# EAGLE design SMeter_RevB (EAGLE 7.6.0)
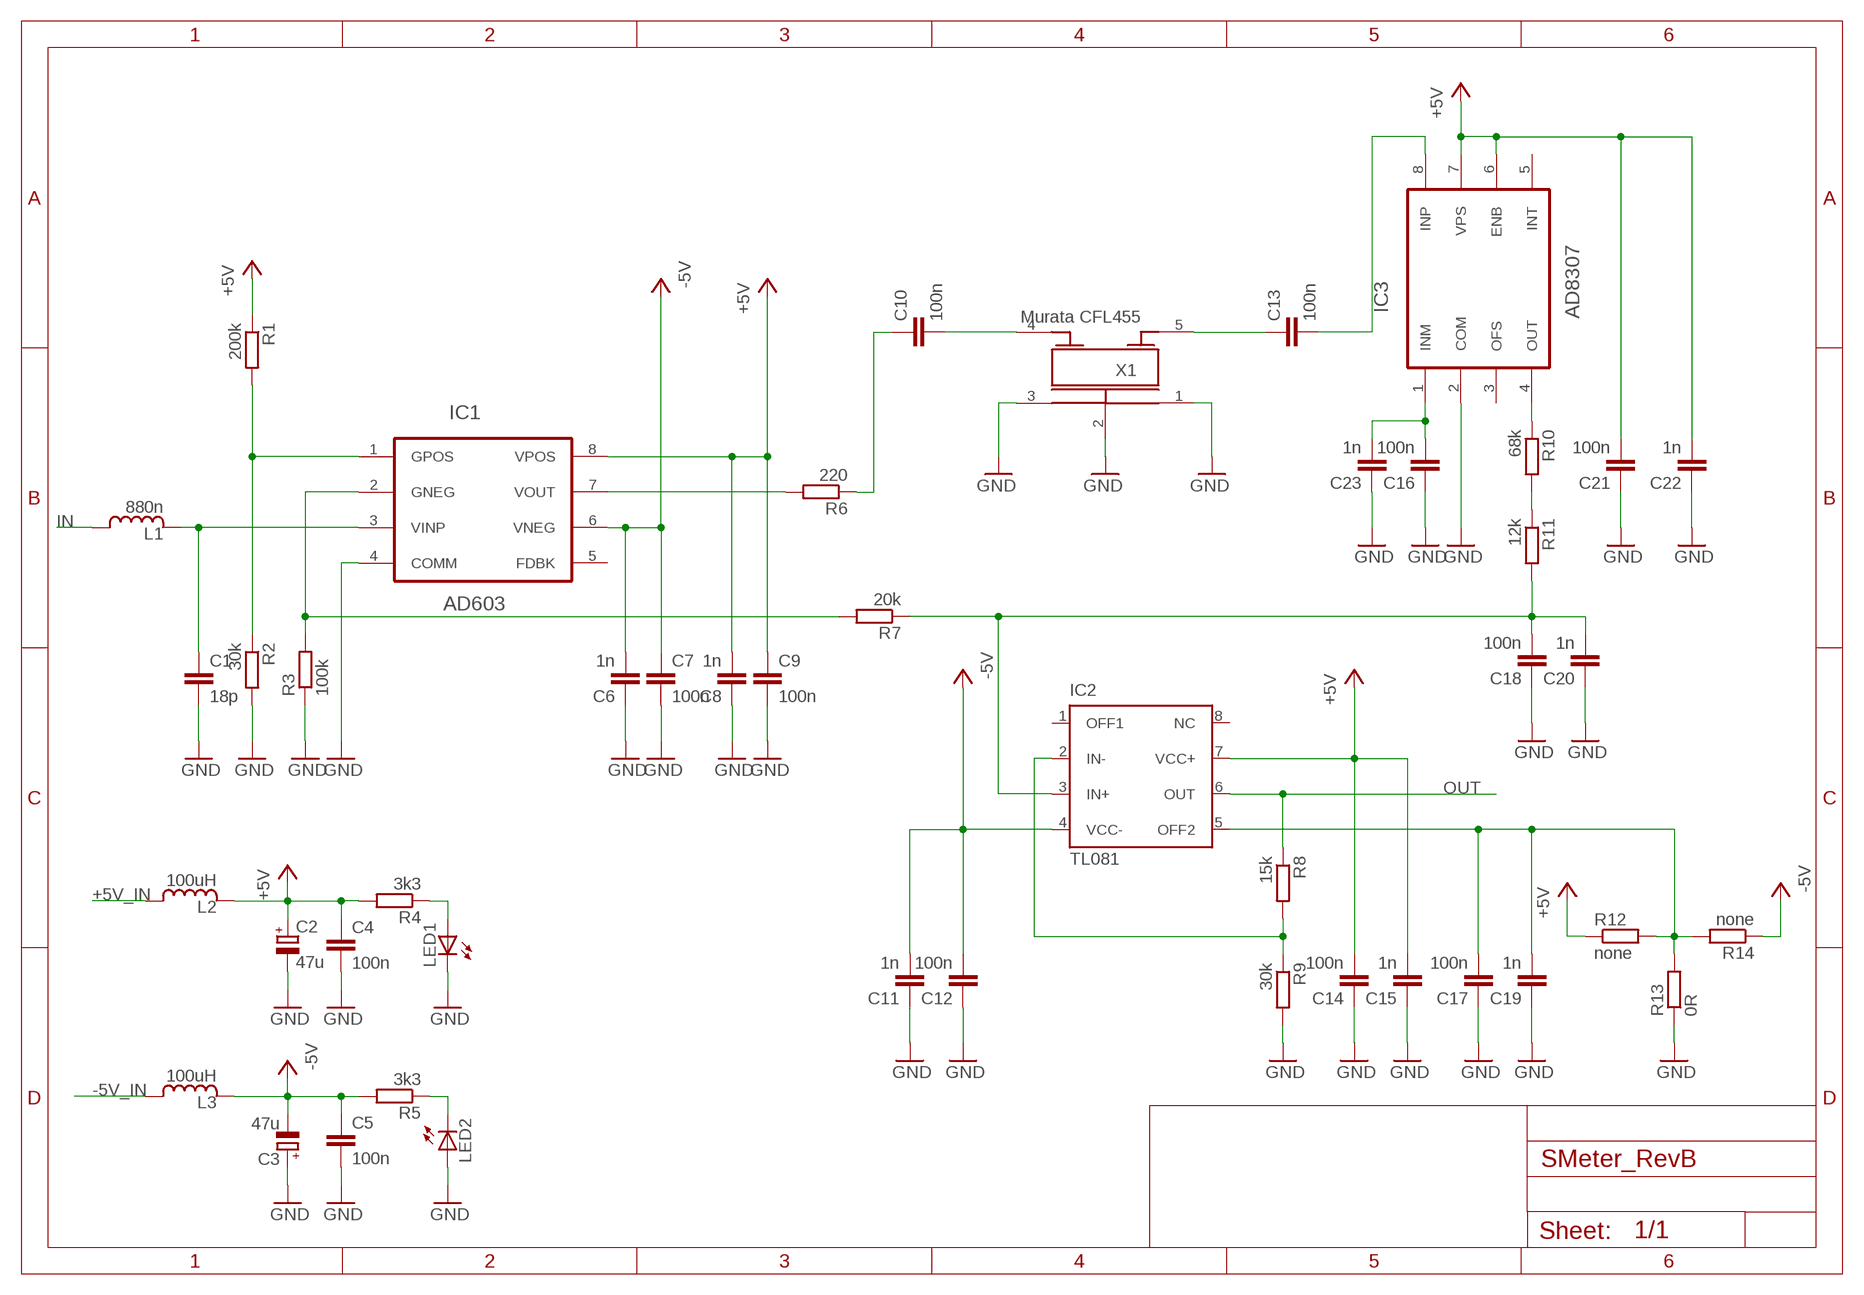
[diagram p0: schematic, sheet 1]

## Parts
C1  18p  CC0805  [C0805]
C2  47u  C_POLARIZEDSMC_B  [SMC_B]
C3  47u  C_POLARIZEDSMC_B  [SMC_B]
C4  100n  CC0805  [C0805]
C5  100n  CC0805  [C0805]
C6  1n  CC0805  [C0805]
C7  100n  CC0805  [C0805]
C8  1n  CC0805  [C0805]
C9  100n  CC0805  [C0805]
C10  100n  CC0805  [C0805]
C11  1n  CC0805  [C0805]
C12  100n  CC0805  [C0805]
C13  100n  CC0805  [C0805]
C14  100n  CC0805  [C0805]
C15  1n  CC0805  [C0805]
C16  100n  CC0805  [C0805]
C17  100n  CC0805  [C0805]
C18  100n  CC0805  [C0805]
C19  1n  CC0805  [C0805]
C20  1n  CC0805  [C0805]
C21  100n  CC0805  [C0805]
C22  1n  CC0805  [C0805]
C23  1n  CC0805  [C0805]
IC1  AD603  [SO8]
IC2  TL081  [SO8]
IC3  AD8307  [SO8]
L1  880n  INDUCTOR0805  [L0805]
L2  100uH  INDUCTORLPS4018  [LPS4018]
L3  100uH  INDUCTORLPS4018  [LPS4018]
LED1  LED0805  [LED0805]
LED2  LED0805  [LED0805]
R1  200k  RESISTORR0805  [R0805]
R2  30k  RESISTORR0805  [R0805]
R3  100k  RESISTORR0805  [R0805]
R4  3k3  RESISTORR0805  [R0805]
R5  3k3  RESISTORR0805  [R0805]
R6  220  RESISTORR0805  [R0805]
R7  20k  RESISTORR0805  [R0805]
R8  15k  RESISTORR0805  [R0805]
R9  30k  RESISTORR0805  [R0805]
R10  68k  RESISTORR0805  [R0805]
R11  12k  RESISTORR0805  [R0805]
R12  none  RESISTORR0805  [R0805]
R13  0R  RESISTORR0805  [R0805]
R14  none  RESISTORR0805  [R0805]
X1  Murata CFL455  CFL455  [CFL455]

## Nets
+5V: C2.+ C4.1 C8.2 C9.1 C14.2 C15.2 C21.2 C22.2 IC1.8(VPOS) IC2.7(VCC+) IC3.6(ENB) IC3.7(VPS) L2.2 R1.1 R4.2 R12.1
+5V_IN: L2.1
-5V: C3.- C5.1 C6.2 C7.1 C11.2 C12.2 IC1.6(VNEG) IC2.4(VCC-) L3.2 R5.2 R14.1
-5V_IN: L3.1
GND: C1.2 C2.- C3.+ C4.2 C5.2 C6.1 C7.2 C8.1 C9.2 C11.1 C12.1 C14.1 C15.1 C16.1 C17.1 C18.1 C19.1 C20.1 C21.1 C22.1 C23.1 IC1.4(COMM) IC3.2(COM) LED1.C LED2.A R2.2 R3.1 R9.2 R13.1 X1.1 X1.2 X1.3
IN: L1.1
N$1: IC1.2(GNEG) R3.2 R7.2
N$2: C1.1 IC1.3(VINP) L1.2
N$3: IC1.1(GPOS) R1.2 R2.1
N$4: IC1.7(VOUT) R6.2
N$5: C10.1 R6.1
N$7: C18.2 C20.2 IC2.3(IN+) R7.1 R11.2
N$8: LED2.C R5.1
N$9: LED1.A R4.1
N$11: C10.2 X1.4
N$12: C13.2 IC3.8(INP)
N$13: C16.2 C23.2 IC3.1(INM)
N$14: IC3.4(OUT) R10.1
N$15: R10.2 R11.1
N$16: C13.1 X1.5
N$17: IC2.2(IN-) R8.2 R9.1
N$19: C17.2 C19.2 IC2.5(OFF2) R12.2 R13.2 R14.2
OUT: IC2.6(OUT) R8.1
Unconnected: IC1.5(FDBK) IC2.1(OFF1) IC2.8(NC) IC3.3(OFS) IC3.5(INT)

## Library data of the parts
C1 C4-C23 = 00Capacitor:C: Capacitor
C2 C3 = 00Capacitor:C_POLARIZED
IC1 = 00Amplifier:AD603: Low Noise, 90 MHz Variable Gain Amplifier
IC2 = 00OpAmp:TL081: JFET-Input Operational Amplifiers
IC3 = 00Amplifier:AD8307: DC to 500 MHz, 92 dB Logarithmic Amplifier
L1-L3 = 00Inductor:INDUCTOR
LED1 LED2 = 00Display:LED: LED
R1-R14 = 00Resistor:RESISTOR: RESISTOR, European symbol
X1 = 00MyParts:CFL455

## Board
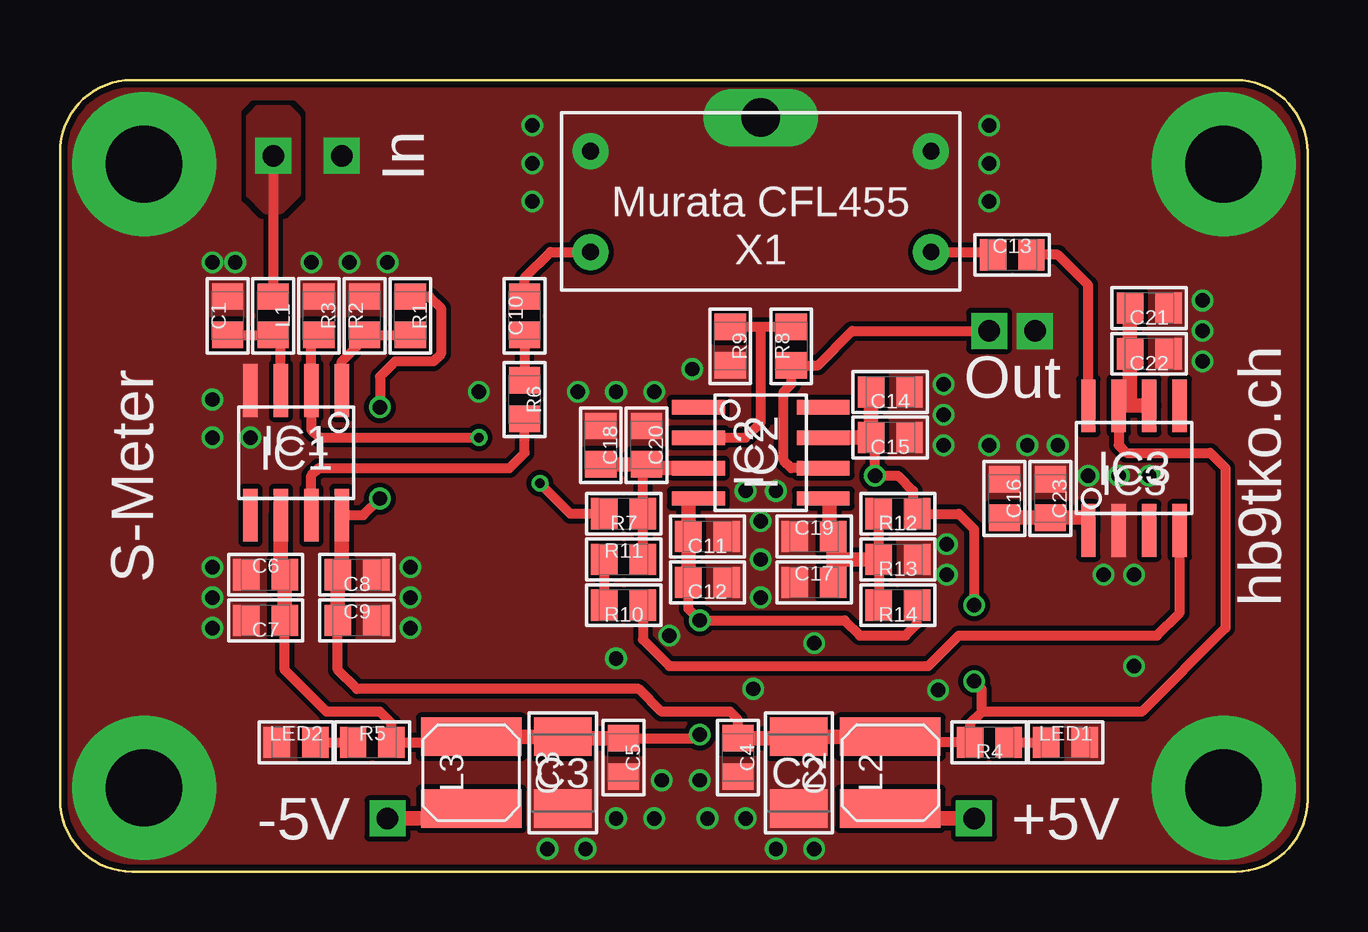
[diagram p1: board, top side]
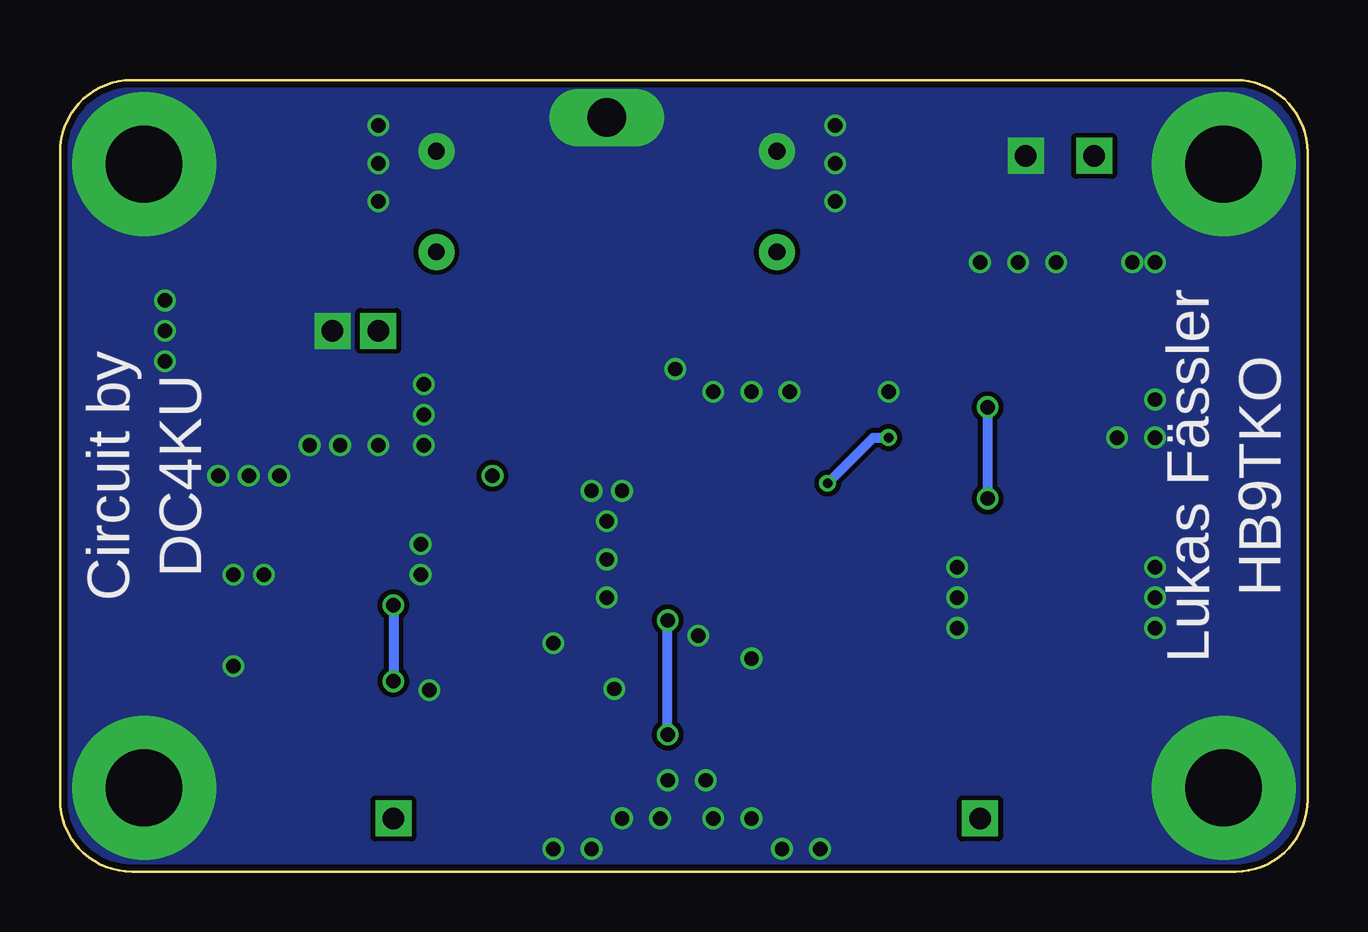
[diagram p2: board, bottom side, seen from below]

Size 52 x 33 mm. Coordinates in mm from the lower left corner, seen from the top.
Outline: 0,30 arc-90 3,33 49,33 arc-90 52,30 52,3 arc-90 49,0 3,0 arc-90 0,3 0,30
Copper layers (1*16): Top 0.035mm / dielectric 1.5mm / Bottom 0.035mm
Design rules "dirt_cheap_dirty_boards.8mil": minimum track width 5mil, minimum drill 12mil, track to track 8mil, track to pad 8mil, pad to pad 8mil, via to via 8mil, smd to smd 0mil, copper to edge 10mil, drill to drill 10mil, minimum pad ring 8mil, minimum via ring 6mil, stop-mask expansion 2mil, vias tented up to drill 25mil, thermal gap 10mil

### Footprints (pad centres in the part's own frame; a part is rotated, then mirrored left to right if it is on the bottom)
C0805 = smd 1.1 x 1.3: 1 -0.8,0; 2 0.8,0
SMC_B = smd 1.6 x 2.4: + -1.5,0; - 1.5,0
SO8 = smd 2.2 x 0.6: 1 -2.6,1.905; 2 -2.6,0.635; 3 -2.6,-0.635; 4 -2.6,-1.905; 5 2.6,-1.905; 6 2.6,-0.635; 7 2.6,0.635; 8 2.6,1.905
L0805 = smd 1.1 x 1.3: 1 -0.8,0; 2 0.8,0
LPS4018 = smd 1.6 x 4.2: 1 -1.5,0; 2 1.5,0
LED0805 = smd 1.1 x 1.3: A -0.8,0; C 0.8,0
R0805 = smd 1.1 x 1.3: 1 -0.8,0; 2 0.8,0
CFL455 = drill 0.7 pad 1.5: 1 -7.1,-2.1; 3 7.1,-2.1; 4 7.1,2.1; 5 -7.1,2.1 | drill 1.6 long: 2 0,-3.5

### Placement (x,y rotation side)
C1  6.99,23.18 90 top
C2  30.8,4.13 270 top
C3  20.95,4.13 90 top
C4  28.26,4.76 270 top
C5  23.5,4.76 270 top
C6  8.57,12.38 0 top
C7  8.57,10.48 180 top
C8  12.38,12.38 180 top
C9  12.38,10.48 0 top
C10  19.37,23.18 90 top
C11  26.99,13.97 180 top
C12  26.99,12.06 180 top
C13  39.69,25.72 0 top
C14  34.61,20 180 top
C15  34.61,18.1 180 top
C16  39.37,15.56 270 top
C17  31.43,12.06 0 top
C18  22.54,17.78 270 top
C19  31.43,13.97 0 top
C20  24.45,17.78 270 top
C21  45.4,23.5 180 top
C22  45.4,21.59 180 top
C23  41.27,15.56 270 top
IC1  9.84,17.46 270 top
IC2  29.21,17.46 0 top
IC3  44.77,16.83 90 top
L1  8.89,23.18 270 top
L2  34.61,4.13 90 top
L3  17.14,4.13 90 top
LED1  41.91,5.4 0 top
LED2  9.84,5.4 0 top
R1  14.61,23.18 270 top
R2  12.7,23.18 90 top
R3  10.79,23.18 270 top
R4  38.73,5.4 180 top
R5  13.02,5.4 0 top
R6  19.37,19.68 270 top
R7  23.5,14.92 180 top
R8  30.48,21.91 90 top
R9  27.94,21.91 270 top
R10  23.5,11.11 180 top
R11  23.5,13.02 0 top
R12  34.92,14.92 180 top
R13  34.92,13.02 180 top
R14  34.92,11.11 180 top
X1  29.21,27.94 180 top

### Tracks (layer width: path | path; a pad name or v marks a point on that pad's centre or on a via)
+5V  (via drill 0.6)
  Top 0.406: 30.8,5.56 C2.+ | R4.2 34.84,5.4 L2.2 | 38.1,5.56 R4.2 | C15.2 33.97,18.1 v33.97,16.51 34.92,16.51 35.56,15.88 35.56,15.09 R12.1 37.47,14.92 38.1,14.29 v38.1,11.11 | IC3.7 44.13,17.78 44.45,17.46 47.94,17.46 48.58,16.83 48.58,10.16 45.09,6.67 38.42,6.67 | 38.42,6.67 37.94,6.18 R4.2 | C4.1 28.26,6.35 27.94,6.67 25.08,6.67 24.13,7.62 12.38,7.62 11.58,8.42 C9.1 | R1.1 15.39,23.98 15.88,23.5 15.88,21.59 15.56,21.27 13.97,21.27 13.34,20.64 v13.34,19.37 | IC1.8 12.64,14.86 v13.34,15.56 | 38.42,6.67 38.42,7.62 v38.1,7.94
  Top 0.61: IC2.7 C15.2 C14.2 | C9.1 C8.2 11.75,12.55 IC1.8 | C4.1 30.73,5.56 C2.+ L2.2 | C21.2 C22.2 44.6,19.43 IC3.7 IC3.6
  Bottom 0.406: v13.34,19.37 v13.34,15.56 | v38.1,11.11 v38.1,7.94
+5V_IN  (via drill 0.9 pad 1.5)
  Top 0.406: 34.61,2.22 L2.1
  Top 0.61: v38.1,2.22 34.61,2.22
-5V  (via drill 0.6)
  Top 0.406: 20.95,5.88 C3.- 20.95,5.56 | L3.2 16.91,5.4 R5.2 13.82,6.18 13.34,6.67 11.11,6.67 9.37,8.41 C7.1 9.53,10.32 | IC2.4 26.35,15.56 | C12.2 26.19,10.96 v26.67,10.48 32.7,10.48 33.34,9.84 35.24,9.84 35.73,10.32 R14.1 | C5.1 26.52,5.56 v26.67,5.71
  Top 0.61: C7.1 C6.2 9.21,12.55 IC1.6 | 20.95,5.56 C5.1 | C3.- 17.87,5.63 17.78,5.71 17.23,5.71 L3.2 | IC2.4 26.19,15.56 C11.2 C12.2
  Bottom 0.406: v26.67,5.71 v26.67,10.48
-5V_IN  (via drill 0.9 pad 1.5)
  Top 0.406: 16.99,2.22 arc90 L3.1
  Top 0.61: v13.65,2.22 16.99,2.22
GND  (via drill 0.6, 0.9 pad 1.5, 3.2 pad 6)
  other vias: 3.5,29.5 48.5,29.5 48.5,3.5 3.5,3.5 28.57,15.88 29.21,14.61 29.84,15.88 29.21,13.02 29.21,11.43 36.83,20.32 40.32,17.78 36.83,19.05 36.83,17.78 41.59,17.78 24.77,20 26.35,20.95 28.89,7.62 26.67,3.81 25.08,3.81 23.18,2.22 24.77,2.22 23.18,8.89 26.99,2.22 28.57,2.22 29.84,0.95 31.43,0.95 20.32,0.95 21.91,0.95 21.59,20 23.18,20 42.86,16.51 44.13,16.51 45.4,16.51 43.5,12.38 44.77,12.38 47.62,23.81 47.62,22.54 47.62,21.27 44.77,8.57 31.43,9.53 25.4,9.84 14.61,12.7 14.61,11.43 14.61,10.16 6.35,11.43 6.35,12.7 36.6,7.57 7.3,25.4 6.35,25.4 6.35,19.68 6.35,18.1 10.48,25.4 13.65,25.4 17.46,20 12.06,25.4 7.94,18.1 19.68,31.11 19.68,29.53 19.68,27.94 38.73,31.11 38.73,29.53 38.73,27.94 38.73,17.78 6.35,10.16 36.97,13.65 36.97,12.38 11.75,29.84 40.64,22.54
  pour Bottom (isolate 0.203, no thermals): 0,1 0,32 arc-90 1,33 51,33 arc-90 52,32 52,1 arc-90 51,0 1,0 arc-90
  pour Top (isolate 0.203, rank 2, no thermals): 0,1 0,32 arc-90 1,33 51,33 arc-90 52,32 52,1 arc-90 51,0 1,0 arc-90
IN  (via drill 0.9 pad 1.5)
  Top 0.406: v8.89,29.84 L1.1
  pour Top (isolate 0.305, no thermals): 9.21,27.62 9.84,28.26 9.84,31.43 9.53,31.75 8.26,31.75 7.94,31.43 7.94,28.26 8.57,27.62
N$1  (via drill 0.4)
  Top 0.406: R3.2 10.48,22.38 IC1.2 10.48,18.41 10.79,18.1 v17.46,18.1 | R7.2 21.27,14.92 v20,16.19
  Bottom 0.406: v20,16.19 18.1,18.1 v17.46,18.1
N$2
  Top 0.406: C1.1 L1.2 9.21,22.38 IC1.3
N$3
  Top 0.406: IC1.1 11.75,21.27 12.7,22.23 R2.1 R1.2
N$4
  Top 0.406: IC1.7 10.48,16.51 10.79,16.83 18.73,16.83 19.37,17.46 R6.2
N$5
  Top 0.406: C10.1 R6.1
N$7
  Top 0.406: 24.6,16.83 C20.2 24.3,16.98 R7.1 R11.2
  Top 0.61: IC2.3 24.6,16.83 | C18.2 C20.2
N$8
  Top 0.406: LED2.C R5.1
N$9
  Top 0.406: R4.1 LED1.A
N$11
  Top 0.406: C10.2 19.37,24.77 20.44,25.84 X1.4
N$12
  Top 0.406: IC3.8 42.86,24.45 41.59,25.72 C13.2
N$13
  Top 0.61: IC3.1 42.86,14.76 C23.2 C16.2
N$14
  Top 0.406: IC3.4 46.67,10.79 45.72,9.84 37.47,9.84 36.2,8.57 25.4,8.57 24.3,9.68 R10.1
N$15
  Top 0.406: R10.2 R11.1
N$16
  Top 0.406: X1.5 38.77,25.84 C13.1
N$17
  Top 0.406: R8.2 29.21,22.71 | 29.21,22.71 R9.1 | IC2.2 28.57,18.1 29.21,18.73 29.21,22.71
N$19
  Top 0.406: R14.2 R13.2 R12.2 | IC2.5 32.07,15.56 | 32.07,14.13 C19.2
  Top 0.61: C17.2 32.23,13.02 | 32.23,13.02 C19.2 | R13.2 32.23,13.02 | 32.07,15.56 32.07,14.13
OUT  (via drill 0.9 pad 1.5)
  Top 0.406: v38.73,22.54 33.02,22.54 31.59,21.11 R8.1 30.48,20.32 30.16,20 30.16,17.14 30.48,16.83 IC2.6

### Text on the board
tPlace: In | Out | S-Meter | hb9tko.ch | -5V | +5V
bPlace: HB9TKO | Lukas Fässler | DC4KU | Circuit by